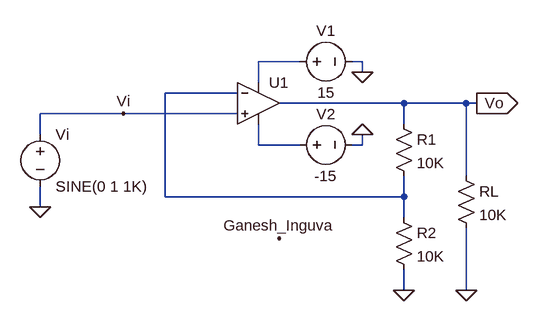
[diagram p0: schematic Run 1_B.asc]
Run 1_B.asc, the LTspice schematic file:
Version 4
SHEET 1 880 680
WIRE 256 16 192 16
WIRE 352 16 336 16
WIRE 352 32 352 16
WIRE 192 48 192 16
WIRE 160 64 48 64
WIRE 416 80 224 80
WIRE 512 80 416 80
WIRE 528 80 512 80
WIRE -16 96 -144 96
WIRE 160 96 -16 96
WIRE 416 112 416 80
WIRE -144 128 -144 96
WIRE 192 144 192 112
WIRE 256 144 192 144
WIRE 352 144 352 128
WIRE 352 144 336 144
WIRE 512 192 512 80
WIRE 48 224 48 64
WIRE 416 224 416 192
WIRE 416 224 48 224
WIRE -144 240 -144 208
WIRE 416 256 416 224
WIRE 416 368 416 336
WIRE 512 368 512 272
FLAG 352 32 0
FLAG 352 128 0
FLAG 416 368 0
FLAG 512 368 0
FLAG 528 80 Vo
IOPIN 528 80 Out
FLAG 224 288 Ganesh_Inguva
FLAG -144 240 0
FLAG -16 96 Vi
SYMBOL OpAmps\\UniversalOpamp2 192 80 R0
SYMATTR InstName U1
SYMBOL voltage 240 16 R270
WINDOW 0 32 56 VTop 2
WINDOW 3 -32 56 VBottom 2
WINDOW 123 0 0 Left 0
WINDOW 39 0 0 Left 0
SYMATTR InstName V1
SYMATTR Value 15
SYMBOL voltage 240 144 R270
WINDOW 0 32 56 VTop 2
WINDOW 3 -32 56 VBottom 2
WINDOW 123 0 0 Left 0
WINDOW 39 0 0 Left 0
SYMATTR InstName V2
SYMATTR Value -15
SYMBOL res 400 96 R0
SYMATTR InstName R1
SYMATTR Value 10K
SYMBOL res 400 240 R0
SYMATTR InstName R2
SYMATTR Value 10K
SYMBOL res 496 176 R0
SYMATTR InstName RL
SYMATTR Value 10K
SYMBOL voltage -144 112 R0
WINDOW 123 0 0 Left 0
WINDOW 39 0 0 Left 0
SYMATTR InstName Vi
SYMATTR Value SINE(0 1 1K)

The netlist it stands for:
* Run 1_B.asc
XU1 Vi N002 N001 N003 Vo level.2 Avol=1Meg GBW=10Meg Slew=10Meg ilimit=25m rail=0 Vos=0 phimargin=45 en=0 enk=0 in=0 ink=0 Rin=500Meg  ; pins IN+ IN- V+ V- OUT
V1 N001 0 15
V2 N003 0 -15
R1 Vo N002 10K
R2 N002 0 10K
RL Vo 0 10K
Vi Vi 0 SINE(0 1 1K)
.lib UniversalOpamps2.sub
.backanno
.end